# Altium schematic sheet sheet_top.SchDoc
size A4
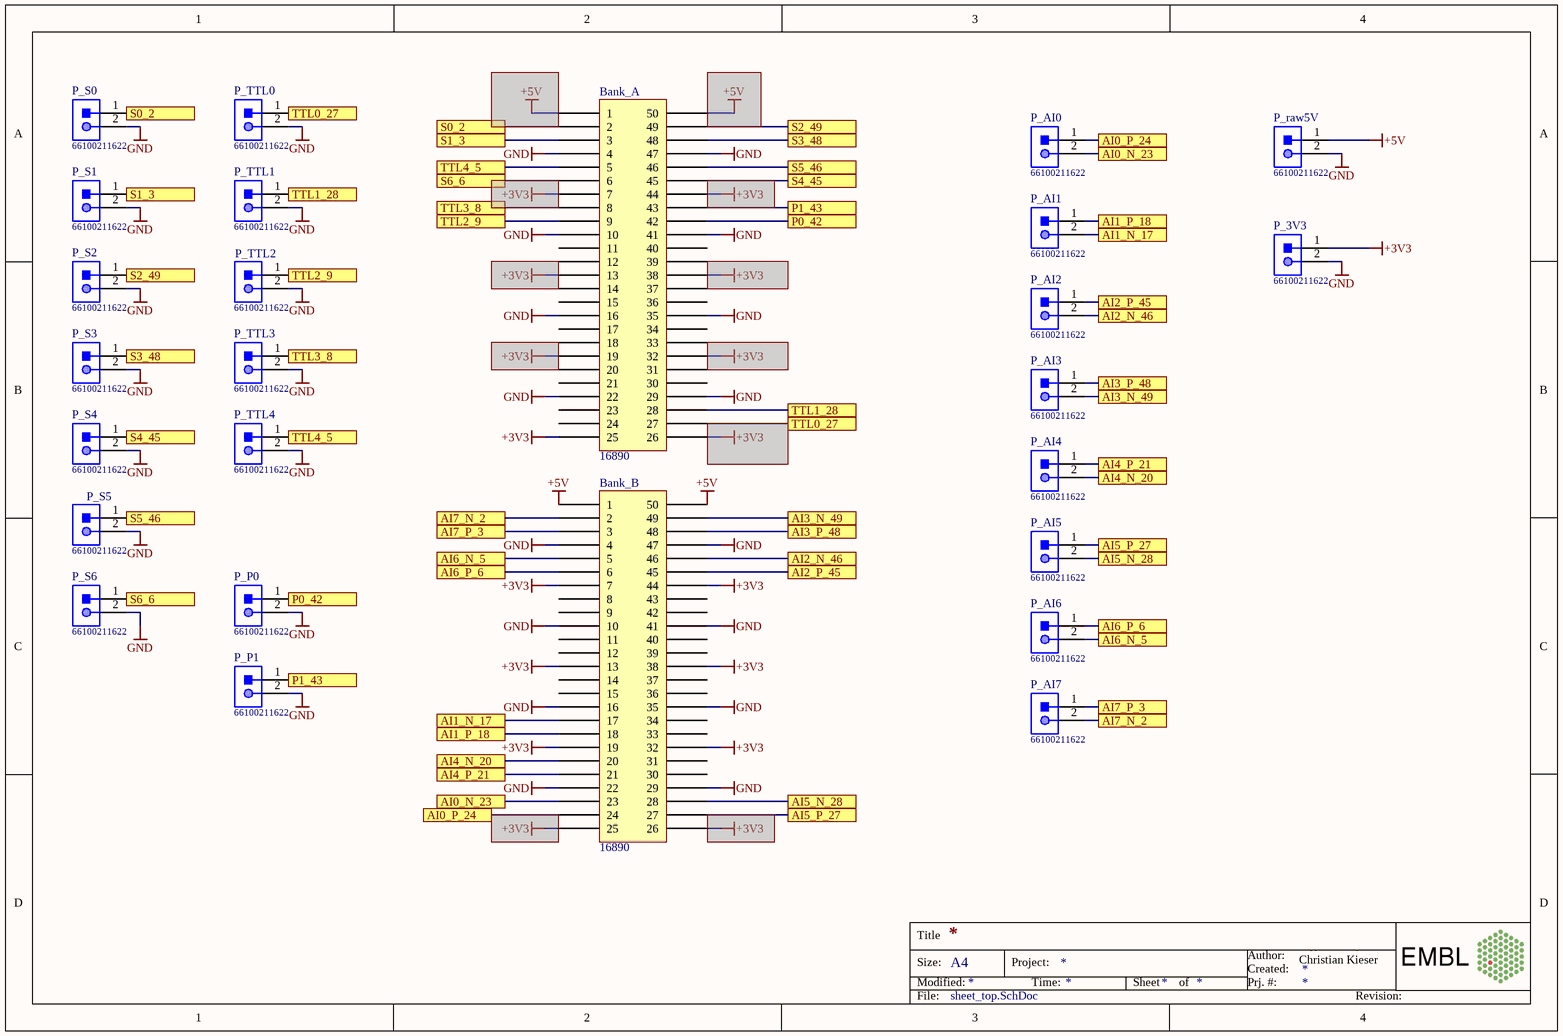
[diagram p0: sheet_top.SchDoc]

## Parts
Bank_A  16890  [SSOP50P500X600-50N]
Bank_B  16890  [SSOP50P500X600-50N]
P_3V3  66100211622  [66100211622]
P_AI0  66100211622  [66100211622]
P_AI1  66100211622  [66100211622]
P_AI2  66100211622  [66100211622]
P_AI3  66100211622  [66100211622]
P_AI4  66100211622  [66100211622]
P_AI5  66100211622  [66100211622]
P_AI6  66100211622  [66100211622]
P_AI7  66100211622  [66100211622]
P_P0  66100211622  [66100211622]
P_P1  66100211622  [66100211622]
P_raw5V  66100211622  [66100211622]
P_S0  66100211622  [66100211622]
P_S1  66100211622  [66100211622]
P_S2  66100211622  [66100211622]
P_S3  66100211622  [66100211622]
P_S4  66100211622  [66100211622]
P_S5  66100211622  [66100211622]
P_S6  66100211622  [66100211622]
P_TTL0  66100211622  [66100211622]
P_TTL1  66100211622  [66100211622]
P_TTL2  66100211622  [66100211622]
P_TTL3  66100211622  [66100211622]
P_TTL4  66100211622  [66100211622]

## Ports
AI0_N_23, AI0_P_24, AI1_N_17, AI1_P_18, AI2_N_46, AI2_P_45, AI3_N_49, AI3_P_48, AI4_N_20, AI4_P_21, AI5_N_28, AI5_P_27, AI6_N_5, AI6_P_6, AI7_N_2, AI7_P_3, P0_42, P1_43, S0_2, S1_3, S2_49, S3_48, S4_45, S5_46, S6_6, TTL0_27, TTL1_28, TTL2_9, TTL3_8, TTL4_5

## Nets
+3V3: Bank_A.25 Bank_B.7 Bank_B.13 Bank_B.19 Bank_B.32 Bank_B.38 Bank_B.44 P_3V3.1
+5V: Bank_B.1 Bank_B.50 P_raw5V.1
GND: Bank_A.4 Bank_A.10 Bank_A.16 Bank_A.22 Bank_A.29 Bank_A.35 Bank_A.41 Bank_A.47 Bank_B.4 Bank_B.10 Bank_B.16 Bank_B.22 Bank_B.29 Bank_B.35 Bank_B.41 Bank_B.47 P_3V3.2 P_P0.2 P_P1.2 P_raw5V.2 P_S0.2 P_S1.2 P_S2.2 P_S3.2 P_S4.2 P_S5.2 P_S6.2 P_TTL0.2 P_TTL1.2 P_TTL2.2 P_TTL3.2 P_TTL4.2
AI0_N_23: Bank_B.23 P_AI0.2 ; port AI0_N_23
AI0_P_24: P_AI0.1 ; port AI0_P_24
AI1_N_17: Bank_B.17 P_AI1.2 ; port AI1_N_17
AI1_P_18: Bank_B.18 P_AI1.1 ; port AI1_P_18
AI2_N_46: Bank_B.46 P_AI2.2 ; port AI2_N_46
AI2_P_45: Bank_B.45 P_AI2.1 ; port AI2_P_45
AI3_N_49: Bank_B.49 P_AI3.2 ; port AI3_N_49
AI3_P_48: Bank_B.48 P_AI3.1 ; port AI3_P_48
AI4_N_20: Bank_B.20 P_AI4.2 ; port AI4_N_20
AI4_P_21: Bank_B.21 P_AI4.1 ; port AI4_P_21
AI5_N_28: Bank_B.28 P_AI5.2 ; port AI5_N_28
AI5_P_27: Bank_B.27 P_AI5.1 ; port AI5_P_27
AI6_N_5: Bank_B.5 P_AI6.2 ; port AI6_N_5
AI6_P_6: Bank_B.6 P_AI6.1 ; port AI6_P_6
AI7_N_2: Bank_B.2 P_AI7.2 ; port AI7_N_2
AI7_P_3: Bank_B.3 P_AI7.1 ; port AI7_P_3
P0_42: Bank_A.42 P_P0.1 ; port P0_42
P1_43: Bank_A.43 P_P1.1 ; port P1_43
S0_2: P_S0.1 ; port S0_2
S1_3: Bank_A.3 P_S1.1 ; port S1_3
S2_49: Bank_A.49 P_S2.1 ; port S2_49
S3_48: Bank_A.48 P_S3.1 ; port S3_48
S4_45: Bank_A.45 P_S4.1 ; port S4_45
S5_46: Bank_A.46 P_S5.1 ; port S5_46
S6_6: P_S6.1 ; port S6_6
TTL0_27: P_TTL0.1 ; port TTL0_27
TTL1_28: Bank_A.28 P_TTL1.1 ; port TTL1_28
TTL2_9: Bank_A.9 P_TTL2.1 ; port TTL2_9
TTL3_8: P_TTL3.1 ; port TTL3_8
TTL4_5: Bank_A.5 P_TTL4.1 ; port TTL4_5

Not connected (* = marked no-connect by the designer): Bank_A 1 2 6 7 8 11 12 13 14 15 17 18 19 20 21 23 24 26 27 30 31 32 33 34 36 37 38 39 40 44 50; Bank_B 8 9 11 12 14 15 24 25 26 30 31 33 34 36 37 39 40 42 43

## Notes on the sheet
- Christian Kieser
- Title
- Size:
- Modified:
- A4
- Project:
- Time:
- Sheet
- of
- Created:
- Author:
- Prj. #:
- Alfons Riedinger
- File:
- Revision:

## Library data of the parts
Bank_A Bank_B = CMP-00541-6: Board to Board Double Slot Femal 50 PIN; Manufacturer: Sparkfun; PartNumber: PRT-16890
P_3V3 P_AI0-P_AI7 P_P0 P_P1 P_raw5V P_S0-P_S6 P_TTL0-P_TTL4 = CMP-001-0161-A.3: WR-WTB 2.54 mm Male Vertical Shrouded Header 2 Pins; Manufacturer: Wurth Electronics; Supplier Part Number: 732-14102-ND; PartNumber: 66100211622; Supplier: Digi-Key